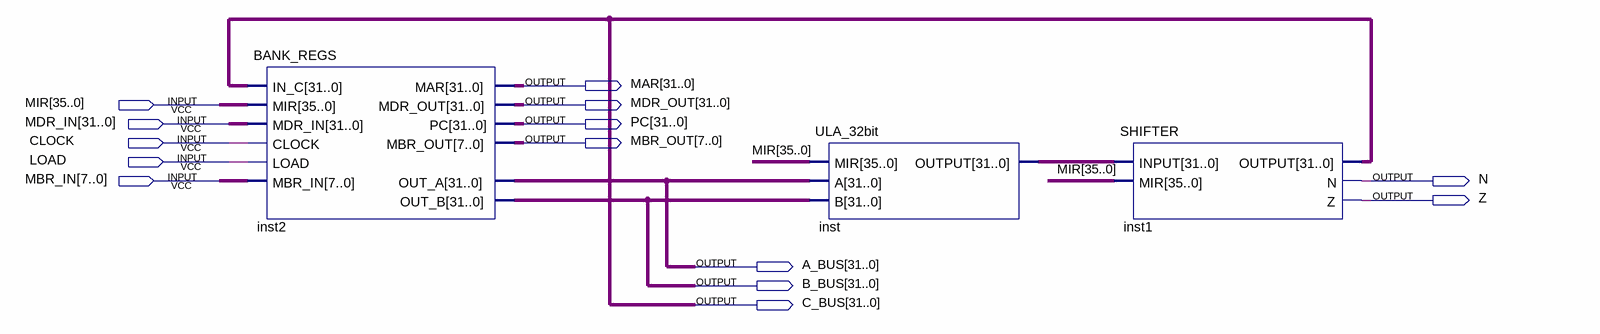
[diagram p0: schematic sheet]
// Quartus schematic mic1.bdf as structural Verilog: 3 symbols, 14 pins
module mic1 (
  input  [35:0] MIR,
  input  [31:0] MDR_IN,
  input  CLOCK,
  input  LOAD,
  input  [7:0] MBR_IN,
  output [31:0] MAR,
  output [31:0] MDR_OUT,
  output [31:0] PC,
  output [7:0] MBR_OUT,
  output N,
  output Z,
  output [31:0] A_BUS,
  output [31:0] B_BUS,
  output [31:0] C_BUS
);

  wire [31:0] inst_output;

  BANK_REGS inst2 (
    .IN_C(C_BUS), .MIR(MIR), .MDR_IN(MDR_IN), .CLOCK(CLOCK), .LOAD(LOAD), .MBR_IN(MBR_IN), .MAR(MAR),
    .OUT_B(B_BUS), .MDR_OUT(MDR_OUT), .PC(PC), .MBR_OUT(MBR_OUT), .OUT_A(A_BUS));
  ULA_32bit inst (.MIR(MIR), .A(A_BUS), .B(B_BUS), .OUTPUT(inst_output));
  SHIFTER inst1 (.INPUT(inst_output), .MIR(MIR), .OUTPUT(C_BUS), .N(N), .Z(Z));
endmodule
